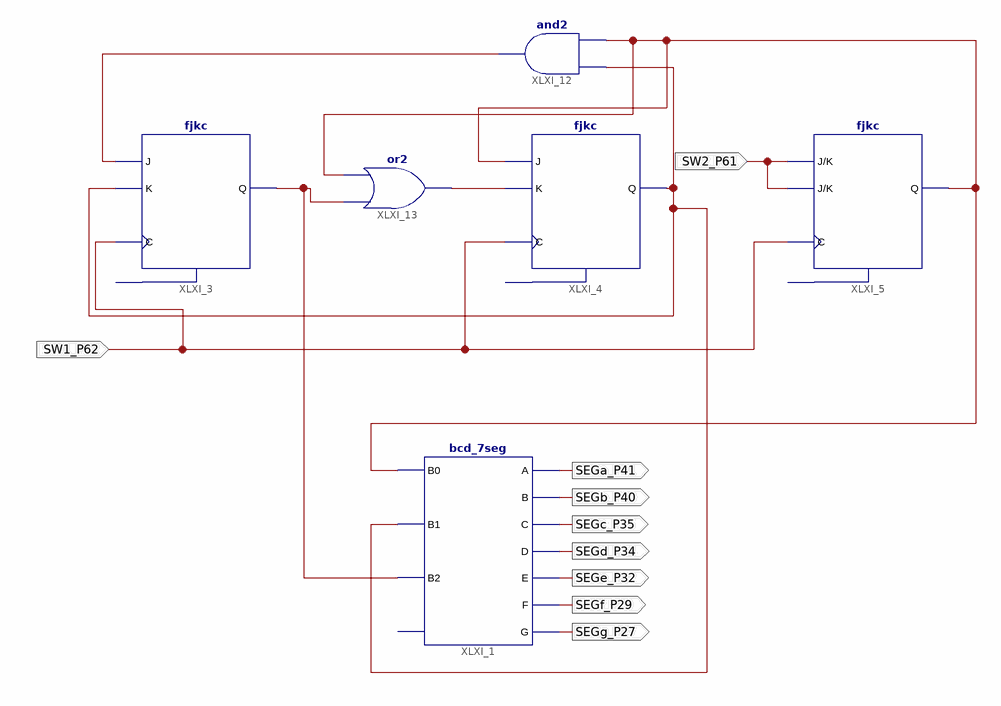
[diagram p0: schematic sheet 1]
// Xilinx ISE schematic Lab_05A_2.sch (spartan6) as structural Verilog: 6 symbols, 9 ports
module Lab_05A_2 (
  input  SW1_P62,
  input  SW2_P61,
  output SEGa_P41,
  output SEGb_P40,
  output SEGc_P35,
  output SEGd_P34,
  output SEGe_P32,
  output SEGf_P29,
  output SEGg_P27
);

  wire XLXN_13, XLXN_25, XLXN_27, XLXN_32, XLXN_34;

  bcd_7seg XLXI_1 (
    .B0(XLXN_25), .B1(XLXN_32), .B2(XLXN_34), .A(SEGa_P41), .B(SEGb_P40), .C(SEGc_P35), .D(SEGd_P34),
    .E(SEGe_P32), .F(SEGf_P29), .G(SEGg_P27));  // open: B3
  fjkc XLXI_3 (.C(SW1_P62), .J(XLXN_13), .K(XLXN_32), .Q(XLXN_34));  // open: CLR
  fjkc XLXI_5 (.C(SW1_P62), .J(SW2_P61), .K(SW2_P61), .Q(XLXN_25));  // open: CLR
  fjkc XLXI_4 (.C(SW1_P62), .J(XLXN_25), .K(XLXN_27), .Q(XLXN_32));  // open: CLR
  and XLXI_12 (XLXN_13, XLXN_32, XLXN_25);
  or XLXI_13 (XLXN_27, XLXN_34, XLXN_25);
endmodule
